# EAGLE design moodlamp (EAGLE 7.7.0)
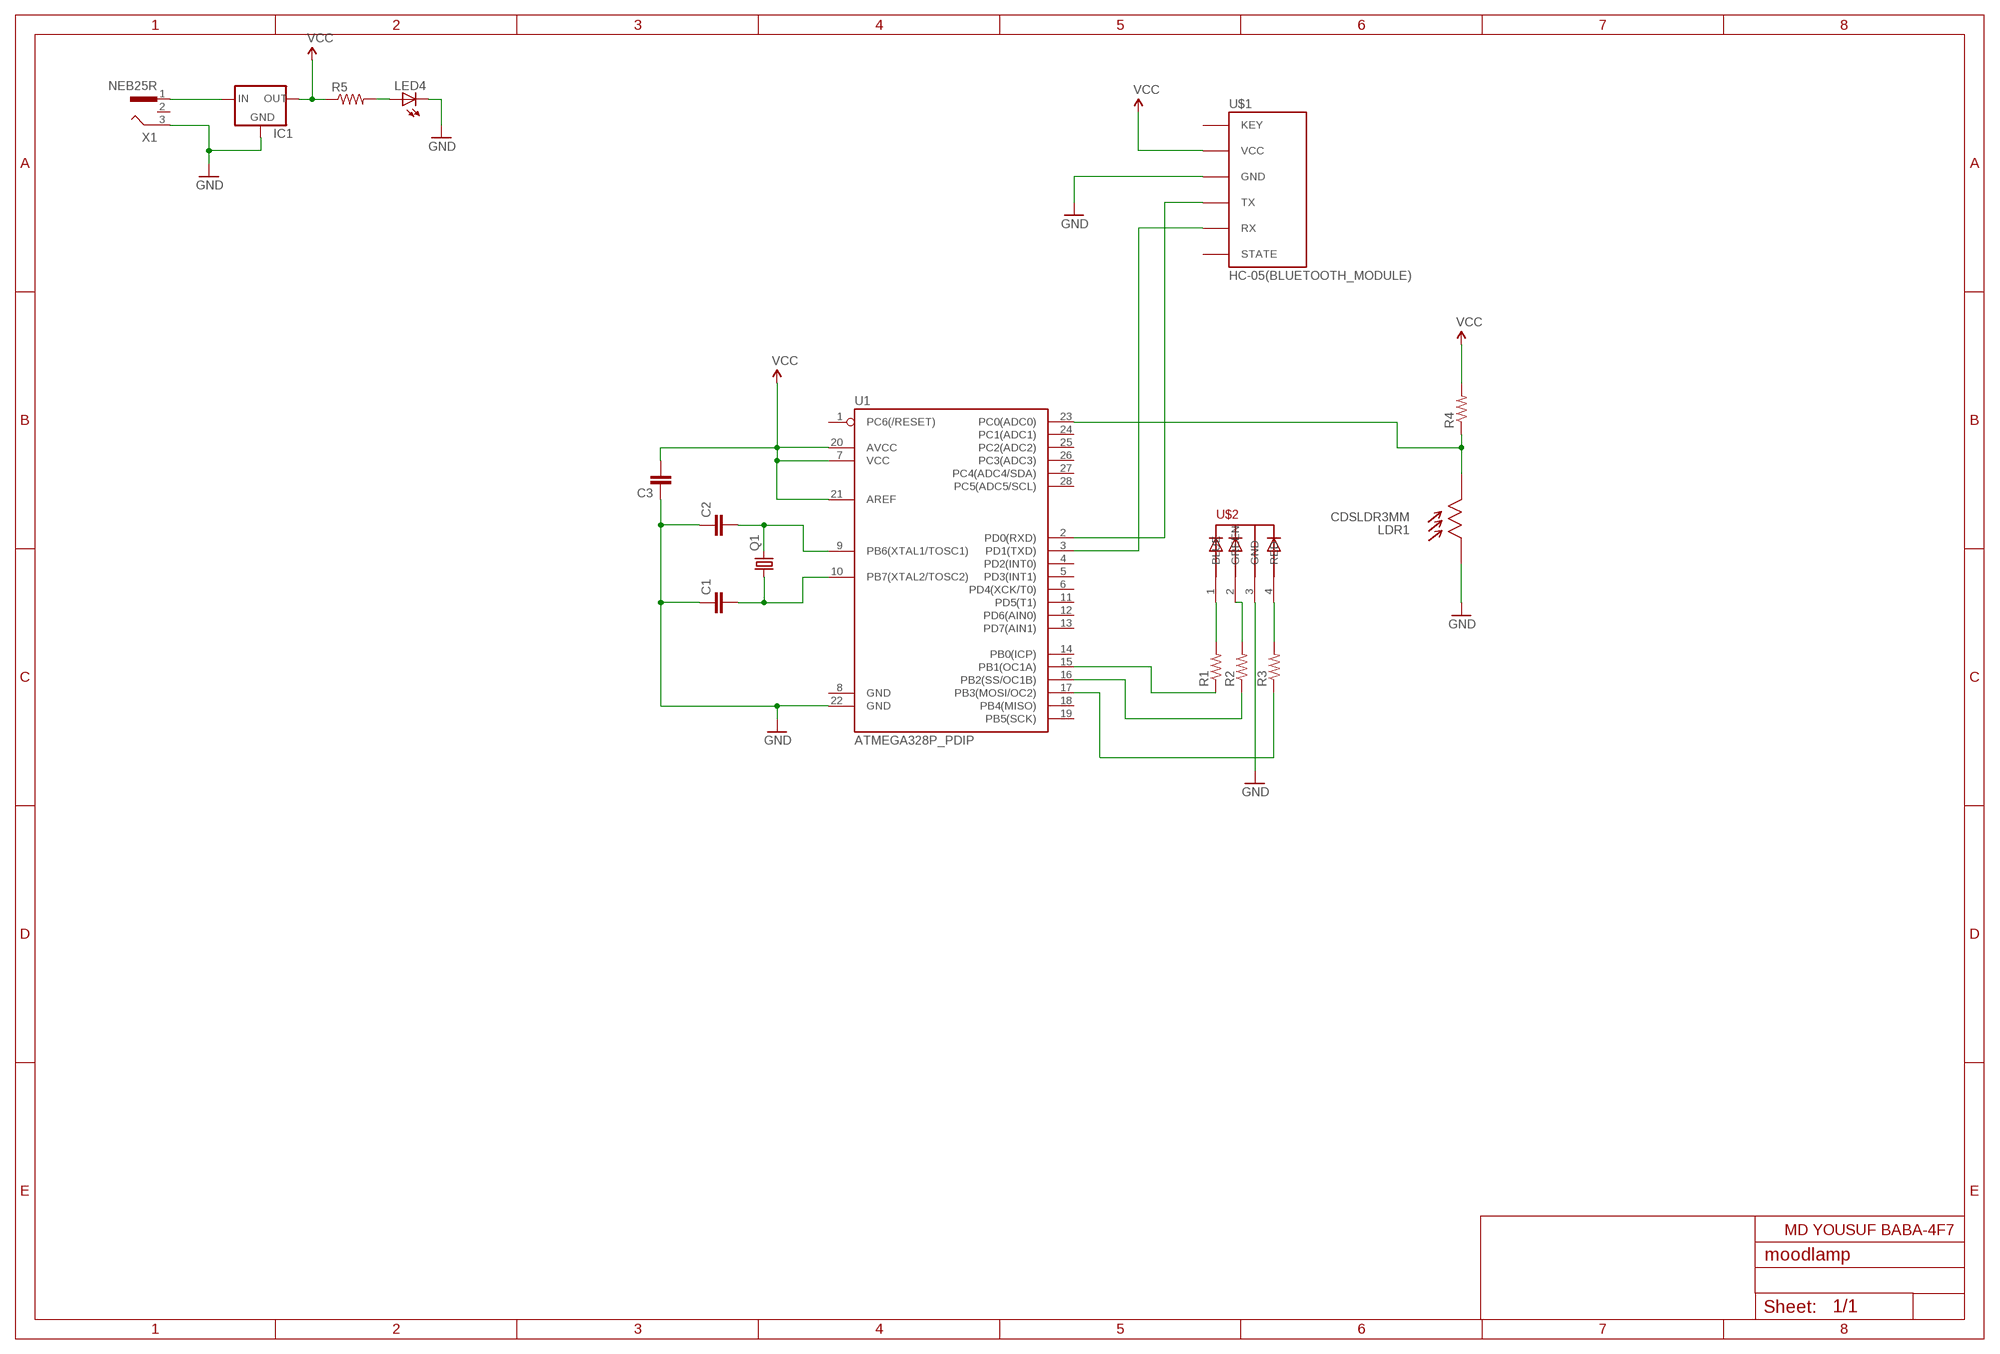
[diagram p0: schematic, sheet 1]

## Parts
C1  C-EU025-024X044  [C025-024X044]
C2  C-EU025-024X044  [C025-024X044]
C3  C-EU025-024X044  [C025-024X044]
IC1  V_REG_78XX-TO-220  [TO-220-ALT]
LDR1  CDSLDR3MM  [LDR3MM]
LED4  LED3MM  [LED3MM]
Q1  CRYSTALHC49US  [HC49US]
R1  RESISTOR0207/7  [0207/7]
R2  RESISTOR0207/7  [0207/7]
R3  RESISTOR0207/7  [0207/7]
R4  RESISTOR0207/7  [0207/7]
R5  RESISTOR0207/7  [0207/7]
U1  ATMEGA328P_PDIP  [DIL28-3]
U$1  HC-05(BLUETOOTH_MODULE)  [HC-05]
U$2  5MMRGBLED  [LED5MMRGB]
X1  NEB25R  [NEB25R]

## Nets
GND: C1.1 C2.1 C3.1 IC1.GND LDR1.P$1 LED4.K(C) U1.22(GND) U$1.GND U$2.3(GND) X1.3
N$1: R1.1 U1.15(PB1(OC1A))
N$2: R2.1 U1.16(PB2(SS/OC1B))
N$3: R3.1 U1.17(PB3(MOSI/OC2))
N$4: R1.2 U$2.1(BLUE)
N$5: R2.2 U$2.2(GREEN)
N$6: R3.2 U$2.4(RED)
N$7: LDR1.P$2 R4.1 U1.23(PC0(ADC0))
N$8: C2.2 Q1.2 U1.9(PB6(XTAL1/TOSC1))
N$9: LED4.A R5.2
N$10: IC1.IN X1.1
N$11: C1.2 Q1.1 U1.10(PB7(XTAL2/TOSC2))
N$12: U1.2(PD0(RXD)) U$1.TX
N$13: U1.3(PD1(TXD)) U$1.RX
VCC: C3.2 IC1.OUT R4.2 R5.1 U1.7(VCC) U1.20(AVCC) U1.21(AREF) U$1.VCC
Unconnected: U1.1(PC6(/RESET)) U1.4(PD2(INT0)) U1.5(PD3(INT1)) U1.6(PD4(XCK/T0)) U1.8(GND) U1.11(PD5(T1)) U1.12(PD6(AIN0)) U1.13(PD7(AIN1)) U1.14(PB0(ICP)) U1.18(PB4(MISO)) U1.19(PB5(SCK)) U1.24(PC1(ADC1)) U1.25(PC2(ADC2)) U1.26(PC3(ADC3)) U1.27(PC4(ADC4/SDA)) U1.28(PC5(ADC5/SCL)) U$1.KEY U$1.STATE X1.2

## Notes on the sheet
- MD YOUSUF BABA-4F7

## Library data of the parts
C1-C3 = assignment:C-EU: CAPACITOR, European symbol
IC1 = SparkFun-PowerIC:V_REG_78XX: Voltage Regulator Standard 7805 5V regulator. IGO (Input Ground Output). Spark Fun Electronics SKU : COM-00107
LDR1 = CEDT_JANUARY_2015_v5:CDSLDR3MM
LED4 = assignment:LED
Q1 = CEDT_JANUARY_2015_v5:CRYSTAL: Crystals Various standard crystals. Proven footprints. Spark Fun Electronics SKU : COM-00534
R1-R5 = CEDT_JANUARY_2015_v5:RESISTOR
U1 = SparkFun-DigitalIC:ATMEGA328P_PDIP: uC used in the Arduino 32kb flash, 1k EEPROM, 2k SRAM This is the through-hole version of this chip.
U$1 = CEDT_JANUARY_2015_v5:HC-05(BLUETOOTH_MODULE)
U$2 = adafruit:5MMRGBLED
X1 = con-lumberg:NEB25R: Klinkeneinbaukupplung; OC_FARNELL: unknown; OC_NEWARK: unknown

## Board
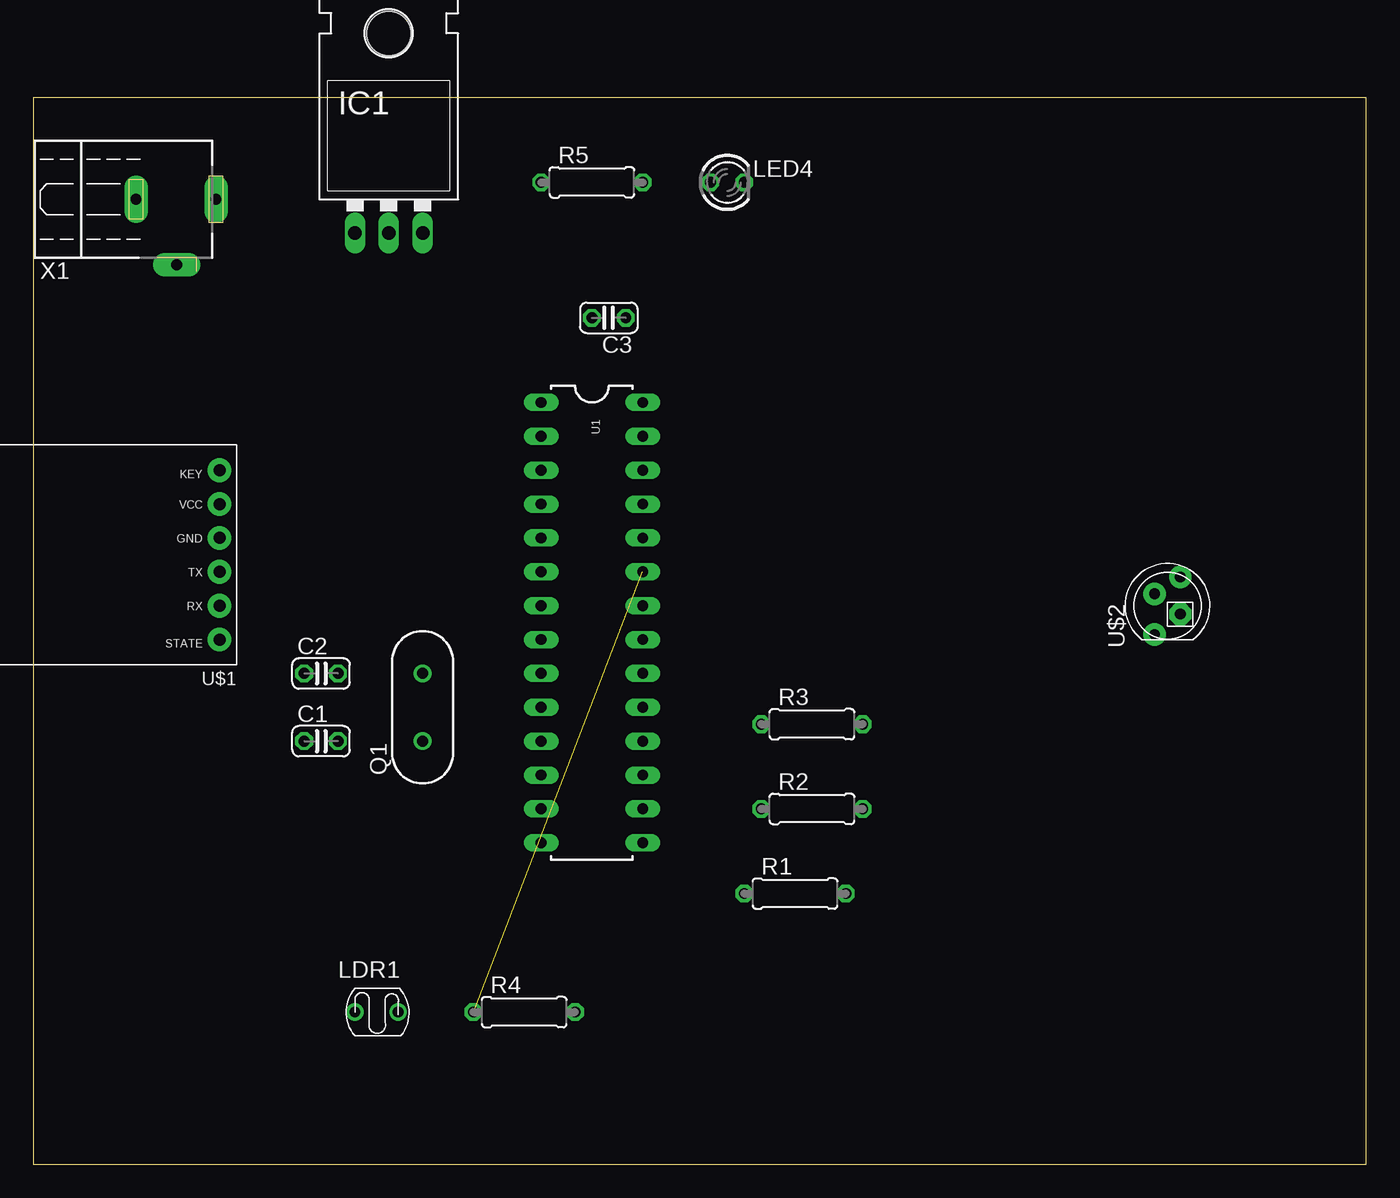
[diagram p1: board, top side]
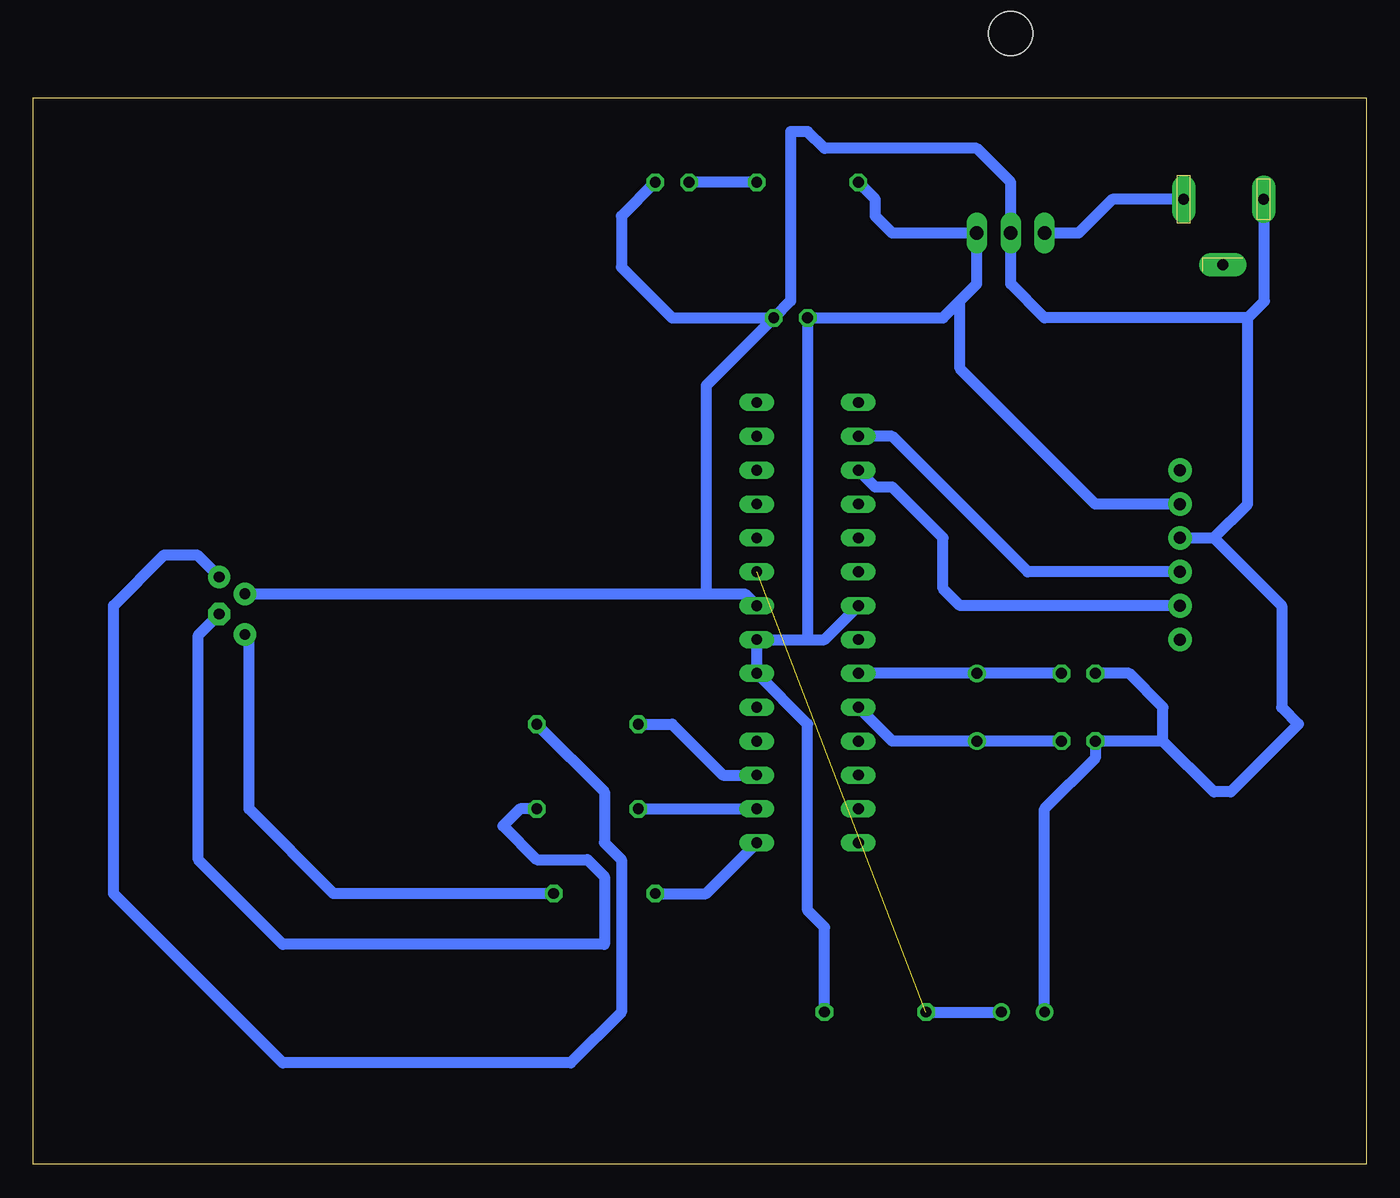
[diagram p2: board, bottom side, seen from below]

Size 100 x 80 mm. Coordinates in mm from the lower left corner, seen from the top.
Outline: 0,0 100,0 100,80 0,80 0,0
Copper layers (1*16): Top 0.035mm / dielectric 1.5mm / Bottom 0.035mm
Design rules "default": minimum track width 6mil, minimum drill 0.35mm, track to track 6mil, track to pad 6mil, pad to pad 6mil, via to via 6mil, smd to smd 6mil, copper to edge 40mil, drill to drill 6mil, minimum pad ring 10mil, minimum via ring 8mil, stop-mask expansion 4mil, vias tented up to drill 0mil, thermal gap 10mil

### Footprints (pad centres in the part's own frame; a part is rotated, then mirrored left to right if it is on the bottom)
C025-024X044 = drill 0.813 octagon: 1 -1.27,0; 2 1.27,0
TO-220-ALT = drill 1.016 long: GND 0,-3.81; IN -2.54,-3.81; OUT 2.54,-3.81 | hole 3.302: 0,11.176
LDR3MM = drill 0.8: P$1 0,0; P$2 3.24,0
LED3MM = drill 0.813 octagon: A -1.27,0; K 1.27,0
HC49US = drill 0.813: 1 -2.54,0; 2 2.54,0
0207/7 = drill 0.813 octagon: 1 -3.81,0; 2 3.81,0
DIL28-3 = drill 0.813 long: 1 -16.51,-3.81; 2 -13.97,-3.81; 3 -11.43,-3.81; 4 -8.89,-3.81; 5 -6.35,-3.81; 6 -3.81,-3.81; 7 -1.27,-3.81; 8 1.27,-3.81; 9 3.81,-3.81; 10 6.35,-3.81; 11 8.89,-3.81; 12 11.43,-3.81; 13 13.97,-3.81; 14 16.51,-3.81; 15 16.51,3.81; 16 13.97,3.81; 17 11.43,3.81; 18 8.89,3.81; 19 6.35,3.81; 20 3.81,3.81; 21 1.27,3.81; 22 -1.27,3.81; 23 -3.81,3.81; 24 -6.35,3.81; 25 -8.89,3.81; 26 -11.43,3.81; 27 -13.97,3.81; 28 -16.51,3.81
HC-05 = drill 0.9 pad 1.778: GND -16.51,-1.27; KEY -16.51,-6.35; RX -16.51,3.81; STATE -16.51,6.35; TX -16.51,1.27; VCC -16.51,-3.81
LED5MMRGB = drill 0.8 pad 1.676: 1 -2.159,0.968; 3 0.889,0.968; 4 2.159,-0.968 | drill 0.8 pad 1.676 octagon: 2 -0.635,-0.968
NEB25R = drill 0.813 pad 1.778 long: 1 0,7.35; 2 4.9,4.4; 3 0,1.35

### Placement (x,y rotation side)
C1  21.59,31.75 0 top
C2  21.59,36.83 0 top
C3  43.18,63.5 180 top
IC1  26.67,73.66 0 top
LDR1  24.13,11.43 0 top
LED4  52.07,73.66 0 top
Q1  29.21,34.29 90 top
R1  57.15,20.32 0 top
R2  58.42,26.67 0 top
R3  58.42,33.02 0 top
R4  36.83,11.43 0 top
R5  41.91,73.66 0 top
U1  41.91,40.64 270 top
U$1  -2.54,45.72 180 top
U$2  85.09,41.91 90 top
X1  6.35,72.39 270 top

### Tracks (layer width: path | path; a pad name or v marks a point on that pad's centre or on a via)
GND
  Bottom 0.813: X1.3 7.7,64.77 | 7.7,64.77 7.7,64.69 | 7.7,64.69 8.89,63.5 | 8.89,63.5 24.13,63.5 26.67,66.04 IC1.GND 26.67,73.66 29.21,76.2 40.64,76.2 41.91,77.47 43.18,77.47 43.18,64.77 C3.1 | LED4.K 55.88,71.12 55.88,67.31 52.07,63.5 C3.1 | U$2.3 49.53,42.8 | 49.53,42.8 46.61,42.8 U1.22 | LDR1.P$1 24.13,26.67 20.32,30.48 C1.1 15.24,31.75 | C3.1 49.53,58.42 49.53,42.8 | U$1.GND 11.43,46.99 | 11.43,46.99 6.35,41.91 6.35,34.29 5.08,33.02 10.16,27.94 11.43,27.94 15.24,31.75 | 15.24,31.75 15.24,34.29 17.78,36.83 C2.1 | 11.43,46.99 8.89,49.53 8.89,63.5 | 7.7,64.69 7.62,64.77 7.7,64.77
N$1
  Bottom 0.813: R1.1 49.53,20.32 U1.15
N$2
  Bottom 0.813: R2.1 U1.16
N$3
  Bottom 0.813: R3.1 52.07,33.02 48.26,29.21 U1.17
N$4
  Bottom 0.813: R1.2 77.47,20.32 83.82,26.67 83.82,39.45 U$2.1
N$5
  Bottom 0.813: R2.2 63.5,26.67 64.77,25.4 62.23,22.86 58.42,22.86 57.15,21.59 57.15,16.51 81.28,16.51 87.63,22.86 87.63,39.7 U$2.2
N$6
  Bottom 0.813: R3.2 57.15,27.94 57.15,24.13 55.88,22.86 55.88,11.43 59.69,7.62 81.28,7.62 93.98,20.32 93.98,41.91 90.17,45.72 87.71,45.72 U$2.4
N$7  (1 unrouted)
  Bottom 0.813: R4.1 LDR1.P$2
N$8
  Bottom 0.813: U1.9 Q1.2 C2.2
N$9
  Bottom 0.813: R5.2 LED4.A
N$10
  Bottom 0.813: X1.1 19.05,72.39 21.59,69.85 IC1.IN
N$11
  Bottom 0.813: U1.10 35.56,31.75 Q1.1 C1.2
N$12
  Bottom 0.813: U$1.TX 25.4,44.45 35.56,54.61 U1.2
N$13
  Bottom 0.813: U$1.RX 30.48,41.91 31.75,43.18 31.75,46.99 35.56,50.8 36.83,50.8 U1.3
VCC
  Bottom 0.813: R5.1 36.83,72.39 36.83,71.12 35.56,69.85 IC1.OUT 29.21,66.04 30.48,64.77 | 30.48,64.77 31.75,63.5 C3.2 41.91,39.37 | R4.2 40.64,17.78 41.91,19.05 41.91,33.02 U1.20 U1.21 41.91,39.37 | 41.91,39.37 40.64,39.37 U1.7 | U$1.VCC 20.32,49.53 30.48,59.69 30.48,64.77